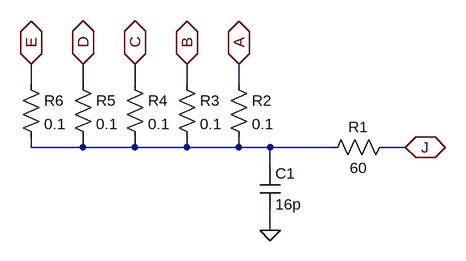
[diagram p0: schematic BB_pin.asc]
BB_pin.asc, the LTspice schematic file:
Version 4
SHEET 1 880 680
WIRE -288 64 -288 32
WIRE -208 64 -208 32
WIRE -128 64 -128 32
WIRE -48 64 -48 32
WIRE 32 64 32 32
WIRE -288 160 -288 144
WIRE -208 160 -208 144
WIRE -208 160 -288 160
WIRE -128 160 -128 144
WIRE -128 160 -208 160
WIRE -48 160 -48 144
WIRE -48 160 -128 160
WIRE 32 160 32 144
WIRE 32 160 -48 160
WIRE 80 160 32 160
WIRE 176 160 80 160
WIRE 288 160 256 160
WIRE 80 192 80 160
WIRE 80 288 80 256
FLAG 32 32 A
IOPIN 32 32 BiDir
FLAG -48 32 B
IOPIN -48 32 BiDir
FLAG 80 288 0
FLAG -128 32 C
IOPIN -128 32 BiDir
FLAG -208 32 D
IOPIN -208 32 BiDir
FLAG -288 32 E
IOPIN -288 32 BiDir
FLAG 288 160 J
IOPIN 288 160 BiDir
SYMBOL res 272 144 R90
WINDOW 0 0 56 VBottom 2
WINDOW 3 32 56 VTop 2
SYMATTR InstName R1
SYMATTR Value 60
SYMBOL cap 64 192 R0
SYMATTR InstName C1
SYMATTR Value 16p
SYMBOL res 16 48 R0
SYMATTR InstName R2
SYMATTR Value 0.1
SYMBOL res -64 48 R0
SYMATTR InstName R3
SYMATTR Value 0.1
SYMBOL res -144 48 R0
SYMATTR InstName R4
SYMATTR Value 0.1
SYMBOL res -224 48 R0
SYMATTR InstName R5
SYMATTR Value 0.1
SYMBOL res -304 48 R0
SYMATTR InstName R6
SYMATTR Value 0.1

The netlist it stands for:
* BB_pin.asc
R1 J N001 60
C1 N001 0 16p
R2 A N001 0.1
R3 B N001 0.1
R4 C N001 0.1
R5 D N001 0.1
R6 E N001 0.1
.backanno
.end